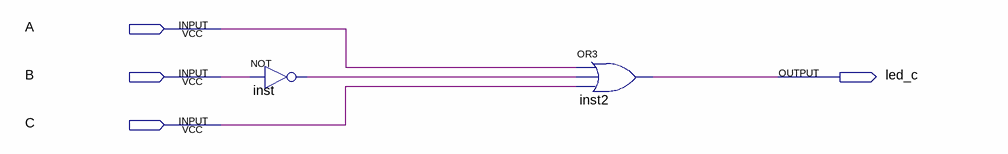
[diagram p0: schematic sheet]
// Quartus schematic led_c.bdf as structural Verilog: 2 symbols, 4 pins
module led_c (
  input  A,
  input  B,
  input  C,
  output led_c
);

  wire inst_out;

  not inst (inst_out, B);
  or inst2 (led_c, A, inst_out, C);
endmodule
